# EAGLE design 2ndOne (EAGLE 9.5.2)
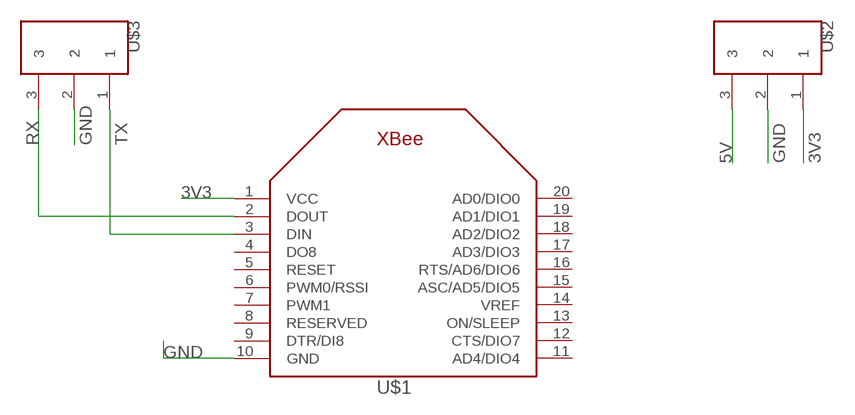
[diagram p0: schematic, sheet 1]

## Parts
U$1  XBEE  [XBEE]
U$2  PIN3  [3PIN]
U$3  PIN3  [3PIN]

## Nets
3V3: U$1.1(VCC) U$2.1
5V: U$2.3
GND: U$1.10(GND) U$2.2 U$3.2
RX: U$1.2(DOUT) U$3.3
TX: U$1.3(DIN) U$3.1
Unconnected: U$1.4(DO8) U$1.5(RESET) U$1.6(PWM0/RSSI) U$1.7(PWM1) U$1.8(RESERVED) U$1.9(DTR/DI8) U$1.11(AD4/DIO4) U$1.12(CTS/DIO7) U$1.13(ON/SLEEP) U$1.14(VREF) U$1.15(ASC/AD5/DIO5) U$1.16(RTS/AD6/DIO6) U$1.17(AD3/DIO3) U$1.18(AD2/DIO2) U$1.19(AD1/DIO1) U$1.20(AD0/DIO0)

## Library data of the parts
U$1 = adafruit:XBEE
U$2 U$3 = 3pin:PIN3

## Board
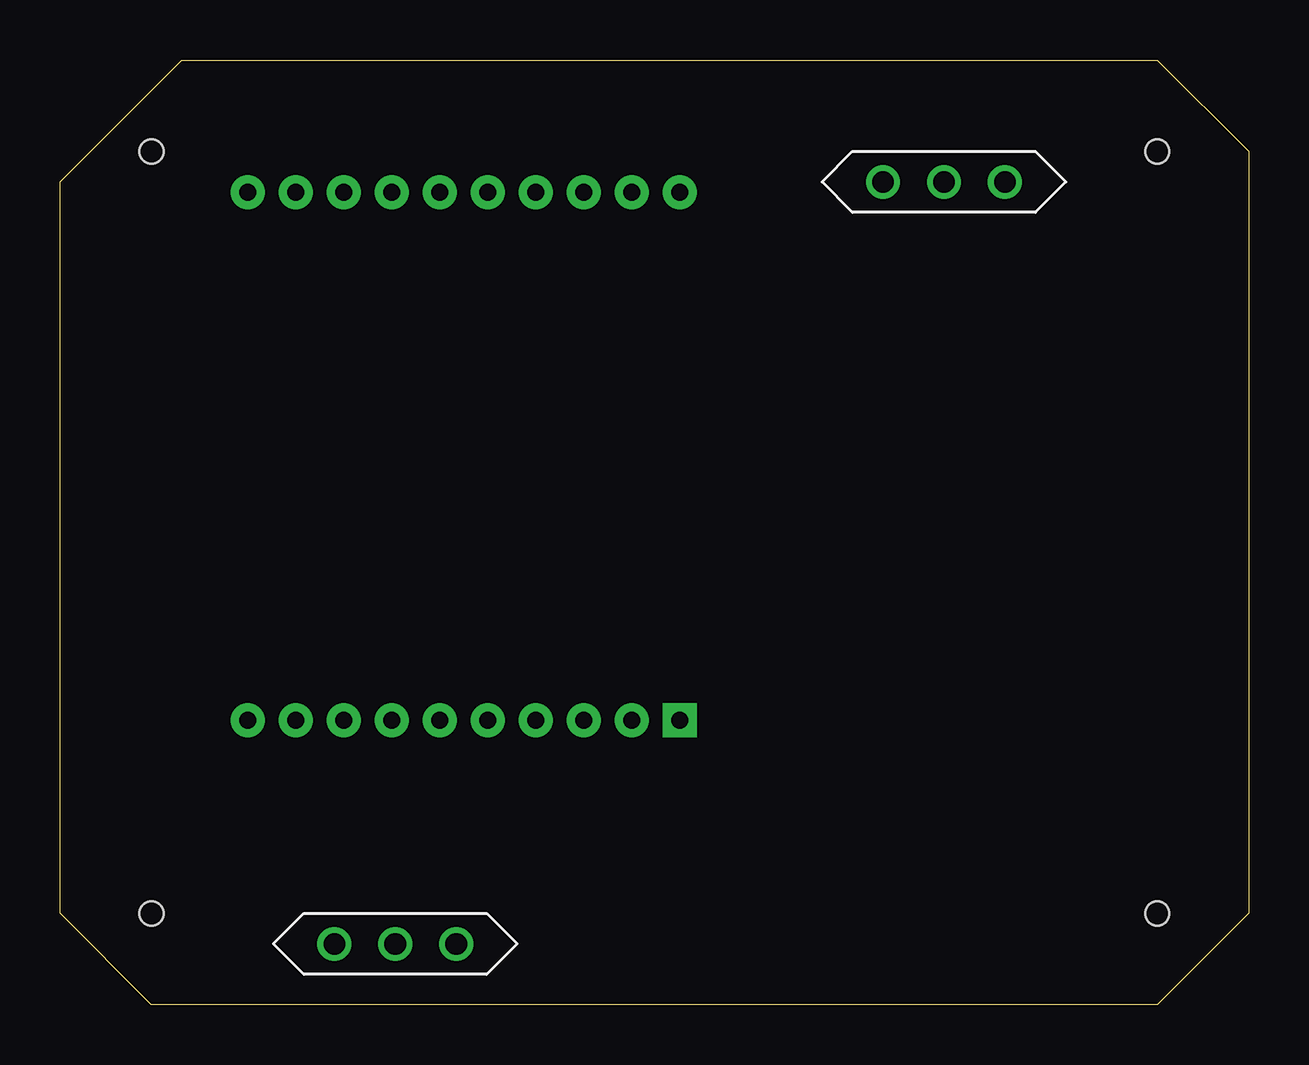
[diagram p1: board, top side]
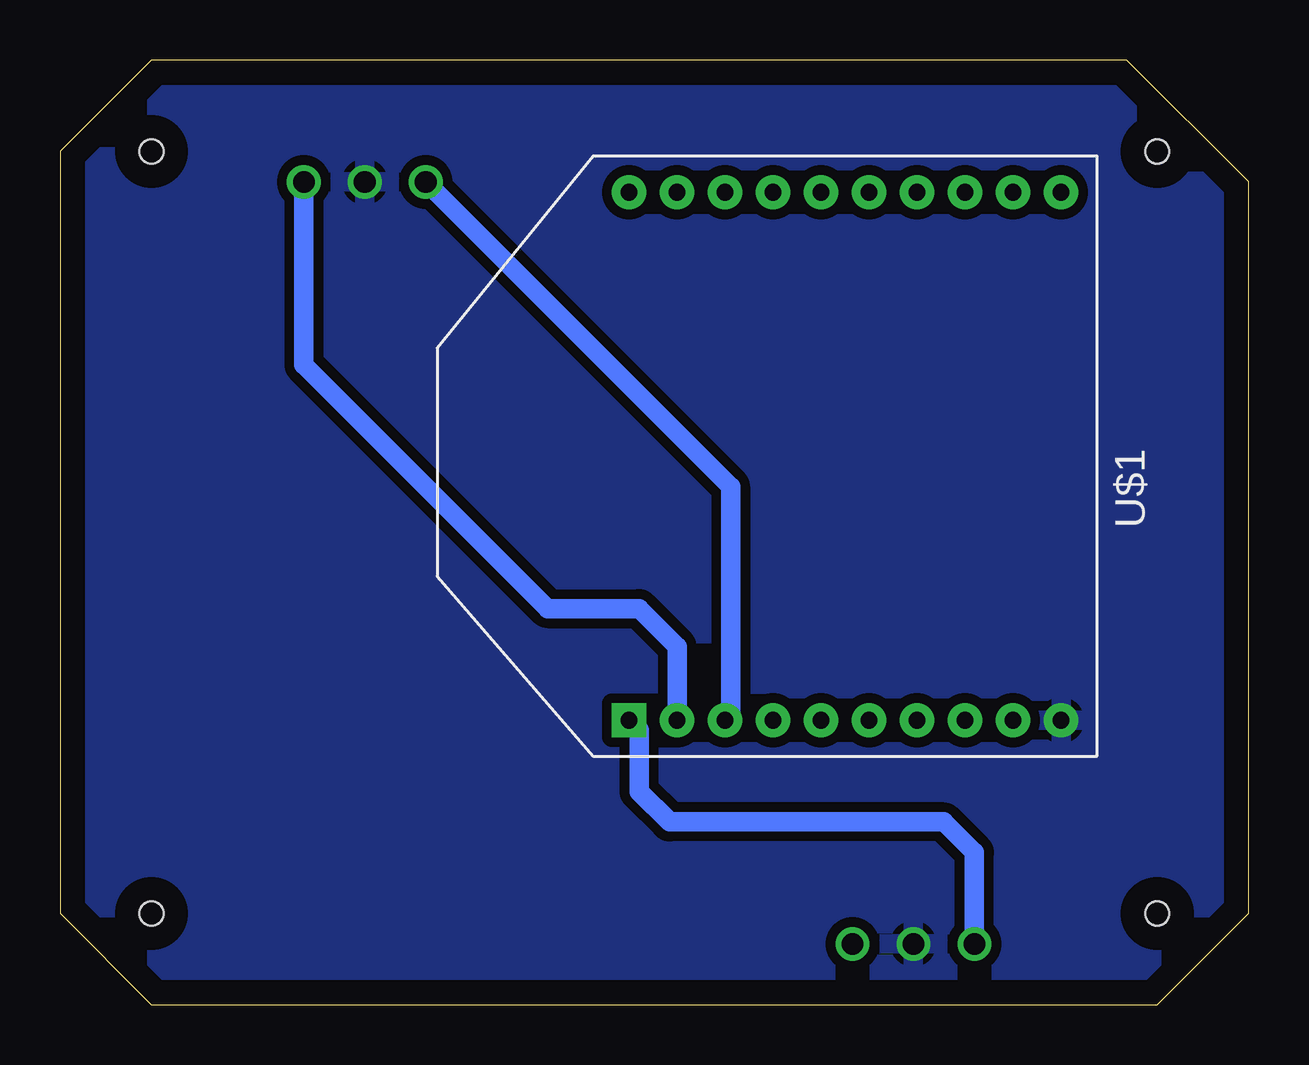
[diagram p2: board, bottom side, seen from below]

Size 49.53 x 39.37 mm. Coordinates in mm from the lower left corner, seen from the top.
Outline: 0,34.29 5.08,39.37 45.72,39.37 49.53,35.56 49.53,3.81 45.72,0 3.81,0 0,3.81 0,34.29
Copper layers (1*16): Top 0.035mm / dielectric 1.5mm / Bottom 0.035mm
Design rules "default": minimum track width 6mil, minimum drill 0.35mm, track to track 6mil, track to pad 6mil, pad to pad 6mil, via to via 6mil, smd to smd 6mil, copper to edge 40mil, drill to drill 6mil, minimum pad ring 10mil, minimum via ring 8mil, stop-mask expansion 4mil, vias tented up to drill 0mil, thermal gap 10mil
Holes 1 mm at 3.81,35.56 45.72,35.56 45.72,3.81 3.81,3.81

### Footprints (pad centres in the part's own frame; a part is rotated, then mirrored left to right if it is on the bottom)
XBEE = drill 0.7 pad 1.422 square: 1 -11,5.5 | drill 0.7 pad 1.422: 2 -11,3.5; 3 -11,1.5; 4 -11,-0.5; 5 -11,-2.5; 6 -11,-4.5; 7 -11,-6.5; 8 -11,-8.5; 9 -11,-10.5; 10 -11,-12.5; 11 11,-12.5; 12 11,-10.5; 13 11,-8.5; 14 11,-6.5; 15 11,-4.5; 16 11,-2.5; 17 11,-0.5; 18 11,1.5; 19 11,3.5; 20 11,5.5
3PIN = drill 0.9: 1 -2.54,0; 2 0,0; 3 2.54,0

### Placement (x,y rotation side)
U$1  20.32,22.86 90 bottom
U$2  13.97,2.54 0 top
U$3  36.83,34.29 0 top

### Tracks (layer width: path | path; a pad name or v marks a point on that pad's centre or on a via)
3V3
  Bottom 0.813: U$2.1 11.43,6.35 12.7,7.62 24.13,7.62 25.4,8.89 25.4,11.44 U$1.1
GND
  pour Bottom (isolate 0.406): 0,34.29 5.08,39.37 45.72,39.37 49.53,35.56 49.53,3.81 45.72,0 3.81,0 0,3.81
RX
  Bottom 0.813: U$3.3 39.37,26.67 29.21,16.51 25.4,16.51 23.82,14.93 U$1.2
TX
  Bottom 0.813: U$3.1 21.59,21.59 21.59,12.09 U$1.3